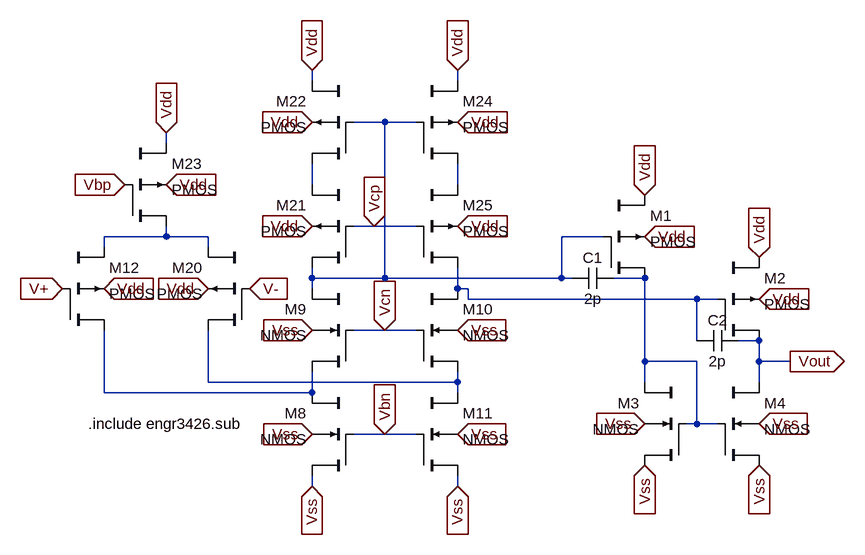
[diagram p0: schematic amptest.asc]
amptest.asc, the LTspice schematic file:
Version 4
SHEET 1 1896 680
WIRE 1040 -464 1040 -480
WIRE 1264 -464 1264 -480
WIRE 1152 -400 1104 -400
WIRE 1200 -400 1152 -400
WIRE 816 -368 816 -384
WIRE 1040 -304 1040 -336
WIRE 1264 -304 1264 -336
WIRE 1136 -240 1104 -240
WIRE 1200 -240 1136 -240
WIRE 816 -224 816 -240
WIRE 816 -224 720 -224
WIRE 880 -224 816 -224
WIRE 1488 -224 1424 -224
WIRE 720 -208 720 -224
WIRE 880 -208 880 -224
WIRE 1040 -160 1040 -176
WIRE 1152 -160 1152 -400
WIRE 1152 -160 1040 -160
WIRE 1424 -160 1424 -224
WIRE 1424 -160 1152 -160
WIRE 1440 -160 1424 -160
WIRE 1552 -160 1504 -160
WIRE 1040 -144 1040 -160
WIRE 1264 -144 1264 -176
WIRE 1280 -144 1264 -144
WIRE 1280 -128 1280 -144
WIRE 1632 -128 1280 -128
WIRE 1664 -128 1632 -128
WIRE 1152 -80 1104 -80
WIRE 1200 -80 1152 -80
WIRE 1632 -64 1632 -128
WIRE 1728 -64 1696 -64
WIRE 1552 -32 1552 -160
WIRE 1632 -32 1552 -32
WIRE 1728 -32 1728 -64
WIRE 1776 -32 1728 -32
WIRE 880 0 880 -80
WIRE 1264 0 1264 -16
WIRE 1264 0 880 0
WIRE 1552 0 1552 -32
WIRE 1728 0 1728 -32
WIRE 720 16 720 -80
WIRE 1040 16 1040 -16
WIRE 1040 16 720 16
WIRE 1264 16 1264 0
WIRE 1632 64 1632 -32
WIRE 1632 64 1616 64
WIRE 1664 64 1632 64
WIRE 1152 80 1104 80
WIRE 1200 80 1152 80
WIRE 1040 160 1040 144
WIRE 1264 160 1264 144
FLAG 752 -304 Vbp
IOPIN 752 -304 In
FLAG 656 -144 V+
IOPIN 656 -144 In
FLAG 944 -144 V-
IOPIN 944 -144 In
FLAG 1152 80 Vbn
IOPIN 1152 80 In
FLAG 1152 -80 Vcn
IOPIN 1152 -80 In
FLAG 1136 -240 Vcp
IOPIN 1136 -240 In
FLAG 816 -384 Vdd
IOPIN 816 -384 In
FLAG 816 -304 Vdd
IOPIN 816 -304 In
FLAG 720 -144 Vdd
IOPIN 720 -144 In
FLAG 880 -144 Vdd
IOPIN 880 -144 In
FLAG 1040 -240 Vdd
IOPIN 1040 -240 In
FLAG 1040 -400 Vdd
IOPIN 1040 -400 In
FLAG 1040 -480 Vdd
IOPIN 1040 -480 In
FLAG 1264 -480 Vdd
IOPIN 1264 -480 In
FLAG 1264 -400 Vdd
IOPIN 1264 -400 In
FLAG 1264 -240 Vdd
IOPIN 1264 -240 In
FLAG 1040 -80 Vss
IOPIN 1040 -80 In
FLAG 1264 -80 Vss
IOPIN 1264 -80 In
FLAG 1040 80 Vss
IOPIN 1040 80 In
FLAG 1264 80 Vss
IOPIN 1264 80 In
FLAG 1040 160 Vss
IOPIN 1040 160 In
FLAG 1264 160 Vss
IOPIN 1264 160 In
FLAG 1776 -32 Vout
IOPIN 1776 -32 Out
FLAG 1552 128 Vss
IOPIN 1552 128 In
FLAG 1728 128 Vss
IOPIN 1728 128 In
FLAG 1728 64 Vss
IOPIN 1728 64 In
FLAG 1552 64 Vss
IOPIN 1552 64 In
FLAG 1552 -224 Vdd
IOPIN 1552 -224 In
FLAG 1552 -288 Vdd
IOPIN 1552 -288 In
FLAG 1728 -192 Vdd
IOPIN 1728 -192 In
FLAG 1728 -128 Vdd
IOPIN 1728 -128 In
SYMBOL cktsym\\nmos4 1040 80 M0
SYMATTR InstName M8
SYMATTR Value2 l=1.8u w=36u
SYMBOL cktsym\\nmos4 1040 -80 M0
SYMATTR InstName M9
SYMATTR Value2 l=1.8u w=36u
SYMBOL cktsym\\nmos4 1264 -80 R0
SYMATTR InstName M10
SYMATTR Value2 l=1.8u w=36u
SYMBOL cktsym\\nmos4 1264 80 R0
SYMATTR InstName M11
SYMATTR Value2 l=1.8u w=36u
SYMBOL cktsym\\pmos4 720 -144 R0
SYMATTR InstName M12
SYMATTR Value2 l=1.8u w=36u
SYMBOL cktsym\\pmos4 880 -144 M0
SYMATTR InstName M20
SYMATTR Value2 l=1.8u w=36u
SYMBOL cktsym\\pmos4 1040 -240 M0
SYMATTR InstName M21
SYMATTR Value2 l=1.8u w=36u
SYMBOL cktsym\\pmos4 1040 -400 M0
SYMATTR InstName M22
SYMATTR Value2 l=1.8u w=36u
SYMBOL cktsym\\pmos4 816 -304 R0
SYMATTR InstName M23
SYMATTR Value2 l=1.8u w=36u
SYMBOL cktsym\\pmos4 1264 -400 R0
SYMATTR InstName M24
SYMATTR Value2 l=1.8u w=36u
SYMBOL cktsym\\pmos4 1264 -240 R0
SYMATTR InstName M25
SYMATTR Value2 l=1.8u w=36u
SYMBOL cktsym\\pmos4 1552 -224 R0
SYMATTR InstName M1
SYMATTR Value2 l=1.8u w=36u
SYMBOL cktsym\\pmos4 1728 -128 R0
SYMATTR InstName M2
SYMATTR Value2 l=1.8u w=36u
SYMBOL cktsym\\nmos4 1552 64 M0
SYMATTR InstName M3
SYMATTR Value2 l=1.8u w=36u
SYMBOL cktsym\\nmos4 1728 64 R0
SYMATTR InstName M4
SYMATTR Value2 l=1.8u w=36u
SYMBOL cap 1504 -176 R90
WINDOW 0 0 32 VBottom 2
WINDOW 3 32 32 VTop 2
SYMATTR InstName C1
SYMATTR Value 2p
SYMBOL cap 1696 -80 R90
WINDOW 0 0 32 VBottom 2
WINDOW 3 32 32 VTop 2
SYMATTR InstName C2
SYMATTR Value 2p
TEXT 696 64 Left 2 !.include engr3426.sub

The netlist it stands for:
* amptest.asc
M8 N008 Vbn Vss Vss NMOS l=1.8u w=36u
M9 N001 Vcn N008 Vss NMOS l=1.8u w=36u
M10 N006 Vcn N007 Vss NMOS l=1.8u w=36u
M11 N007 Vbn Vss Vss NMOS l=1.8u w=36u
M12 N008 V+ N004 Vdd PMOS l=1.8u w=36u
M20 N007 V- N004 Vdd PMOS l=1.8u w=36u
M21 N001 Vcp N002 Vdd PMOS l=1.8u w=36u
M22 N002 N001 Vdd Vdd PMOS l=1.8u w=36u
M23 N004 Vbp Vdd Vdd PMOS l=1.8u w=36u
M24 N003 N001 Vdd Vdd PMOS l=1.8u w=36u
M25 N006 Vcp N003 Vdd PMOS l=1.8u w=36u
M1 N005 N001 Vdd Vdd PMOS l=1.8u w=36u
M2 Vout N006 Vdd Vdd PMOS l=1.8u w=36u
M3 N005 N005 Vss Vss NMOS l=1.8u w=36u
M4 Vout N005 Vss Vss NMOS l=1.8u w=36u
C1 N005 N001 2p
C2 Vout N006 2p
.model NMOS NMOS
.model PMOS PMOS
.lib standard.mos
.include engr3426.sub
.backanno
.end